# Altium schematic sheet Supply_5V0.SchDoc
size Letter
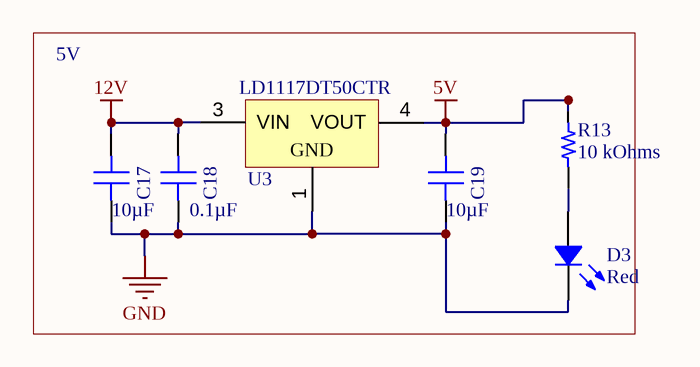
[diagram p0: Supply_5V0.SchDoc]

## Parts
C17  10µF  [CAP 0805_2012]
C18  Capacitance: 0.1µF  [CAP 0805_2012]
C19  10µF  [CAP 0805_2012]
D3  Red  [LED 0603_1608 RED]
R13  10 kOhms  [YAGEO RES 0603_1608]
U3  LD1117DT50CTR  [DPAK456P1010X240-3N]

## Blocks framed on the sheet
5V: C17-C19 D3 R13 U3

## Nets
5V: C19.1 R13.2 U3.4(VOUT)
12V: C17.1 C18.1 U3.3(VIN)
GND: C17.2 C18.2 C19.2 D3.2 U3.1(GND)
NetD3_1: D3.1 R13.1

## Notes on the sheet
- DWG. NO.
- REV.
- SHT.
- REVISION
- DESCRIPTION
- DATE
- APPROVED
- THIS DOCUMENT AND THE DATA DISCLOSED HEREIN OR HEREWITH IS THE PROPERTY OF ALTIUM LIMITED AND MAY BE FREELY DISTRIBUTED IN WHOLE. NO RIGHTS ARE RESERVED OR EXPRESS OR IMPLIED WARANTEE GIVEN.
- ENG:
- DSN:
- APPROVALS
- PROJECT
- DOCUMENT REVISION:
- DESIGN ITEM:
- CHK:
- BOM:
- REFERENCE DOCUMENTS
- PROJECT REVISION:
- TITLE
- FAB DWG:
- PCB DWG:
- ASSY DWG:
- SCALE:
- SIZE
- C
- CAGE CODE
- FILE NAME
- DWG NO.
- SHEET
- OF
- REV

## Library data of the parts
C17 C19 = 0805YD106KAT2A: CAP CER 10UF 16V X5R 0805; manufacturer: AVX Corporation; Tolerance: ±10%; value: 10µF; Part Number: 0805YD106KAT2A; Applications: General Purpose; componentlink1description: Datasheet; componentlink1url: http://datasheets.avx.com/cx5r.pdf; componentlink2description: DigiKey Link; componentlink2url: http://digikey.com/product-detail/en/avx-corporation/0805YD106KAT2A/478-5165-1-ND/1913255; Device Package: 0805 (2012 Metric); lastupdated: 2020-09-02 01:04:16; Lifecycle Status: Active; Minimum Order: 1; Mounting Type: Surface Mount, MLCC; Operating Temperature: -55°C ~ 85°C; Package / Case: 0805 (2012 Metric); packaging: TapeAndReel; partid: 15295; Part Status: Active; price: 0.16; series: -; Size / Dimension: 0.079" L x 0.049" W (2.01mm x 1.25mm); Supplier 1: DigiKey; Supplier Part Number 1: 478-5165-1-ND; Temperature Coefficient: X5R; Thickness (Max): 0.055" (1.40mm); Voltage - Rated: 16V
C18 = 08053E104ZAT2A: CAP CER 0.1UF 25V Z5U 0805; manufacturer: AVX Corporation; Tolerance: -20%, +80%; Part Number: 08053E104ZAT2A; Applications: General Purpose; componentlink2description: DigiKey Link; componentlink2url: http://digikey.com/product-detail/en/avx-corporation/08053E104ZAT2A/478-12769-1-ND/9949310; Device Package: 0805 (2012 Metric); lastupdated: 2020-09-02 01:04:40; Lifecycle Status: Active; Minimum Order: 1; Mounting Type: Surface Mount, MLCC; Operating Temperature: 10°C ~ 85°C; Package / Case: 0805 (2012 Metric); packaging: TapeAndReel; partid: 3602; Part Status: Active; price: 0.04; series: -; Size / Dimension: 0.079" L x 0.049" W (2.00mm x 1.25mm); Supplier 1: DigiKey; Supplier Part Number 1: 478-12769-1-ND; Temperature Coefficient: Z5U; Thickness (Max): 0.037" (0.94mm); Voltage - Rated: 25V
D3 = LR Q976.01-P2R2-1: LED RED CLEAR 0603 SMD; Manufacturer: ams-OSRAM USA Inc.; Current - Test: 20mA; Lens Color: Colorless; Lens Size: 1.10mm x 0.80mm; Lens Style: Rectangle with Flat Top; Millicandela Rating: 118mcd; Viewing Angle: 140°; Voltage - Forward (Vf) (Typ): 2V; Wavelength - Dominant: 623nm; Wavelength - Peak: 628nm; Part Number: LR Q976.01-P2R2-1; Color: Red; ComponentLink2Description: DigiKey Link; ComponentLink2URL: https://www.digikey.com/en/products/detail/ams-osram-usa-inc/LR-Q976-01-P2R2-1/21556490; Device Package: 0603 (1608 Metric); Height (Max): 0.75mm; LastUpdated: 2024-06-03 19:59:37; Lens Transparency: Clear; Lifecycle Status: Active; Minimum Order: 1; Mounting Type: Surface Mount; Package / Case: 0603 (1608 Metric); Packaging: TapeAndReel; PartId: 1467; Price: 0.02; Series: LO Q976.01; Size / Dimension: 1.60mm L x 0.80mm W; Supplier 1: DigiKey; Supplier Part Number 1: 475-LRQ976.01-P2R2-1CT-ND; Supplier Device Package: 0603; Value: Red
R13 = AC0603JR-0710KL: RES SMD 10K OHM 5% 1/10W 0603; Manufacturer: Yageo; Power (Watts): 0.1W, 1/10W; Temperature Coefficient: ±100ppm/°C; Part Number: AC0603JR-0710KL; Value: 10 kOhms; ComponentLink1Description: Datasheet; ComponentLink1URL: https://www.yageo.com/upload/media/product/productsearch/datasheet/rchip/PYu-AC_51_RoHS_L_7.pdf; ComponentLink2Description: DigiKey Link; ComponentLink2URL: https://www.digikey.com/en/products/detail/yageo/AC0603JR-0710KL/2827830; Composition: Thick Film; Device Package: 0603 (1608 Metric); Features: Automotive AEC-Q200, Moisture Resistant; Height - Seated (Max): 0.022" (0.55mm); LastUpdated: 2024-07-25 09:19:28; Lifecycle Status: Active; Minimum Order: 1; Number of Terminations: 2; Operating Temperature: -55°C ~ 155°C; Package / Case: 0603 (1608 Metric); Packaging: CutTape; PartId: 12247; Part Status: Active; Price: 0.01; Ratings: AEC-Q200; Resistance: 10 kOhms; Series: AC; Size / Dimension: 0.063" L x 0.031" W (1.60mm x 0.80mm); Supplier 1: DigiKey; Supplier Part Number 1: 311-10KLECT-ND; Supplier Device Package: 0603; Tolerance: ±5%
U3 = LD1117DT50CTR: Fixed Low Drop Positive Voltage Regulator, 5V, 3-Pin DPAK, Tape and Reel; ComponentLink1Description: Manufacturer URL; ComponentLink2Description: Datasheet; DatasheetVersion: 1/11/2011; ComponentLink1URL: http://www.st.com; PackageVersion: 2011; PackageDescription: 3-Pin Transistor Outline Package 2.28 mm Pitch, 9.7 mm Lead Span (DPAK); ComponentLink2URL: http://www.st.com/internet/com/TECHNICAL_RESOURCES/TECHNICAL_LITERATURE/DATASHEET/CD00000544.pdf; PackageReference: TO-252; PartNumber: LD1117DT50CTR